# Altium project audio_interface.PrjPcb (part 2 of 2)

## Sheet bal2un_1.SchDoc
size A4
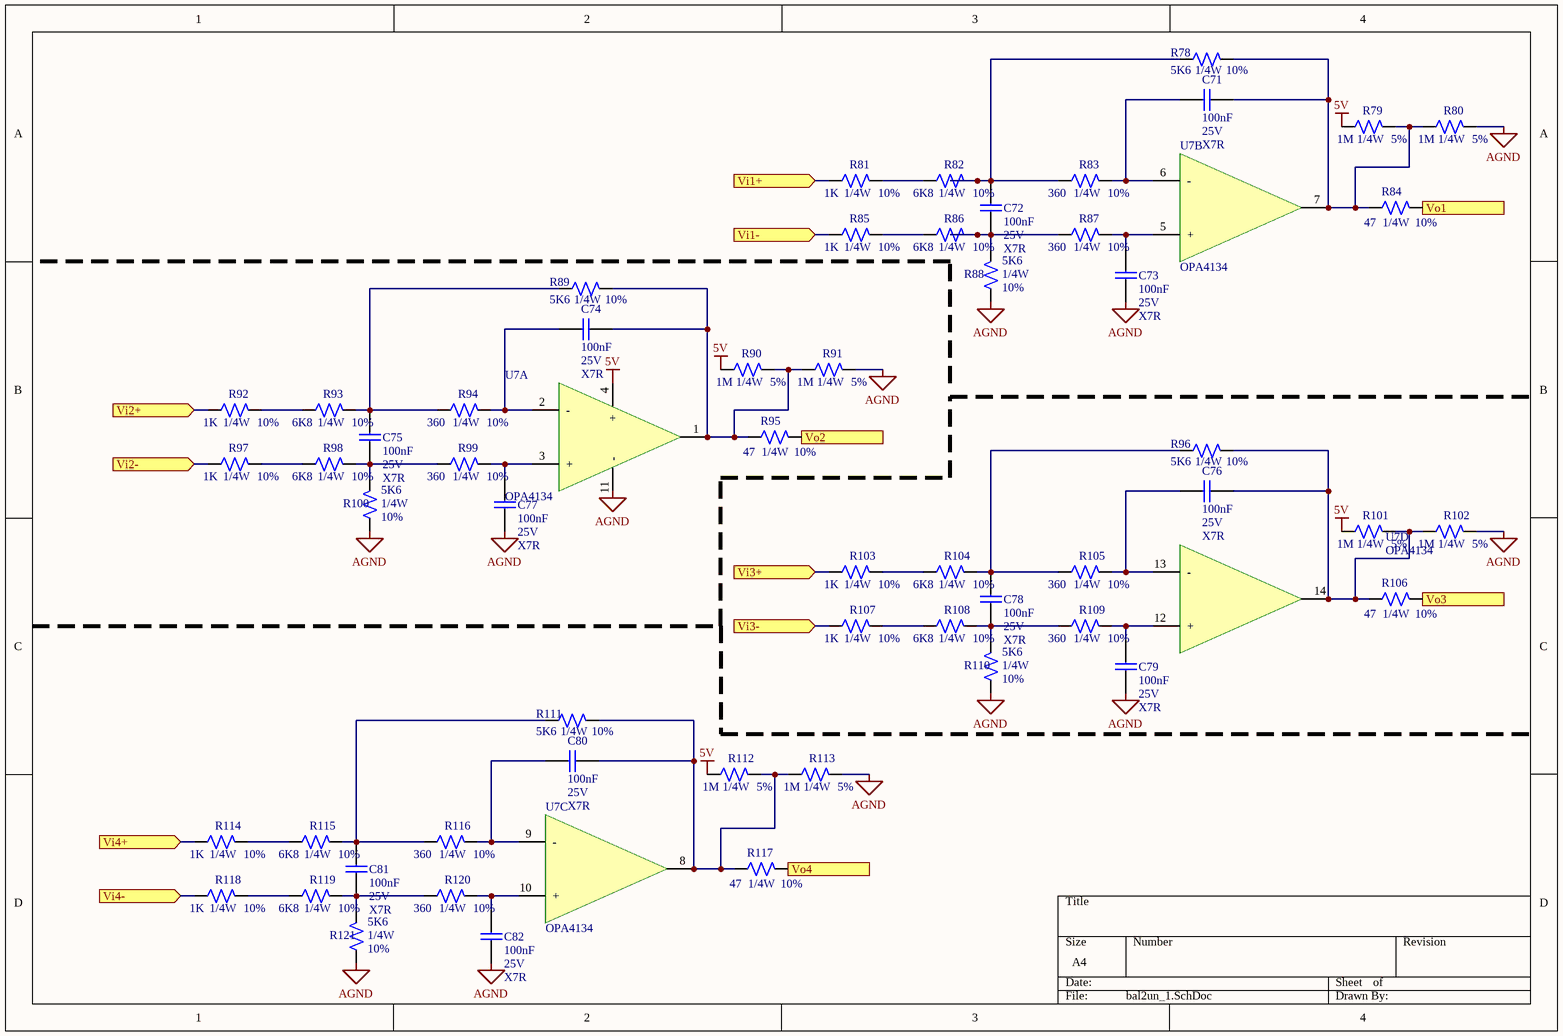
[diagram p12: bal2un_1.SchDoc]

### Parts
C71  valor: 100nF  tension: 25V  tolerancia: X7R  [C0805]  (hidden comment: Capacitor)
C72  valor: 100nF  tension: 25V  tolerancia: X7R  [C0805]  (hidden comment: Capacitor)
C73  valor: 100nF  tension: 25V  tolerancia: X7R  [C0805]  (hidden comment: Capacitor)
C74  valor: 100nF  tension: 25V  tolerancia: X7R  [C0805]  (hidden comment: Capacitor)
C75  valor: 100nF  tension: 25V  tolerancia: X7R  [C0805]  (hidden comment: Capacitor)
C76  valor: 100nF  tension: 25V  tolerancia: X7R  [C0805]  (hidden comment: Capacitor)
C77  valor: 100nF  tension: 25V  tolerancia: X7R  [C0805]  (hidden comment: Capacitor)
C78  valor: 100nF  tension: 25V  tolerancia: X7R  [C0805]  (hidden comment: Capacitor)
C79  valor: 100nF  tension: 25V  tolerancia: X7R  [C0805]  (hidden comment: Capacitor)
C80  valor: 100nF  tension: 25V  tolerancia: X7R  [C0805]  (hidden comment: Capacitor)
C81  valor: 100nF  tension: 25V  tolerancia: X7R  [C0805]  (hidden comment: Capacitor)
C82  valor: 100nF  tension: 25V  tolerancia: X7R  [C0805]  (hidden comment: Capacitor)
R78  Valor: 5K6  Potencia: 1/4W  Tolerancia: 10%  [R0805]  (hidden comment: Resistor)
R79  Valor: 1M  Potencia: 1/4W  Tolerancia: 5%  [R0805]  (hidden comment: Resistor)
R80  Valor: 1M  Potencia: 1/4W  Tolerancia: 5%  [R0805]  (hidden comment: Resistor)
R81  Valor: 1K  Potencia: 1/4W  Tolerancia: 10%  [R0805]  (hidden comment: Resistor)
R82  Valor: 6K8  Potencia: 1/4W  Tolerancia: 10%  [R0805]  (hidden comment: Resistor)
R83  Valor: 360  Potencia: 1/4W  Tolerancia: 10%  [R0805]  (hidden comment: Resistor)
R84  Valor: 47  Potencia: 1/4W  Tolerancia: 10%  [R0805]  (hidden comment: Resistor)
R85  Valor: 1K  Potencia: 1/4W  Tolerancia: 10%  [R0805]  (hidden comment: Resistor)
R86  Valor: 6K8  Potencia: 1/4W  Tolerancia: 10%  [R0805]  (hidden comment: Resistor)
R87  Valor: 360  Potencia: 1/4W  Tolerancia: 10%  [R0805]  (hidden comment: Resistor)
R88  Valor: 5K6  Potencia: 1/4W  Tolerancia: 10%  [R0805]  (hidden comment: Resistor)
R89  Valor: 5K6  Potencia: 1/4W  Tolerancia: 10%  [R0805]  (hidden comment: Resistor)
R90  Valor: 1M  Potencia: 1/4W  Tolerancia: 5%  [R0805]  (hidden comment: Resistor)
R91  Valor: 1M  Potencia: 1/4W  Tolerancia: 5%  [R0805]  (hidden comment: Resistor)
R92  Valor: 1K  Potencia: 1/4W  Tolerancia: 10%  [R0805]  (hidden comment: Resistor)
R93  Valor: 6K8  Potencia: 1/4W  Tolerancia: 10%  [R0805]  (hidden comment: Resistor)
R94  Valor: 360  Potencia: 1/4W  Tolerancia: 10%  [R0805]  (hidden comment: Resistor)
R95  Valor: 47  Potencia: 1/4W  Tolerancia: 10%  [R0805]  (hidden comment: Resistor)
R96  Valor: 5K6  Potencia: 1/4W  Tolerancia: 10%  [R0805]  (hidden comment: Resistor)
R97  Valor: 1K  Potencia: 1/4W  Tolerancia: 10%  [R0805]  (hidden comment: Resistor)
R98  Valor: 6K8  Potencia: 1/4W  Tolerancia: 10%  [R0805]  (hidden comment: Resistor)
R99  Valor: 360  Potencia: 1/4W  Tolerancia: 10%  [R0805]  (hidden comment: Resistor)
R100  Valor: 5K6  Potencia: 1/4W  Tolerancia: 10%  [R0805]  (hidden comment: Resistor)
R101  Valor: 1M  Potencia: 1/4W  Tolerancia: 5%  [R0805]  (hidden comment: Resistor)
R102  Valor: 1M  Potencia: 1/4W  Tolerancia: 5%  [R0805]  (hidden comment: Resistor)
R103  Valor: 1K  Potencia: 1/4W  Tolerancia: 10%  [R0805]  (hidden comment: Resistor)
R104  Valor: 6K8  Potencia: 1/4W  Tolerancia: 10%  [R0805]  (hidden comment: Resistor)
R105  Valor: 360  Potencia: 1/4W  Tolerancia: 10%  [R0805]  (hidden comment: Resistor)
R106  Valor: 47  Potencia: 1/4W  Tolerancia: 10%  [R0805]  (hidden comment: Resistor)
R107  Valor: 1K  Potencia: 1/4W  Tolerancia: 10%  [R0805]  (hidden comment: Resistor)
R108  Valor: 6K8  Potencia: 1/4W  Tolerancia: 10%  [R0805]  (hidden comment: Resistor)
R109  Valor: 360  Potencia: 1/4W  Tolerancia: 10%  [R0805]  (hidden comment: Resistor)
R110  Valor: 5K6  Potencia: 1/4W  Tolerancia: 10%  [R0805]  (hidden comment: Resistor)
R111  Valor: 5K6  Potencia: 1/4W  Tolerancia: 10%  [R0805]  (hidden comment: Resistor)
R112  Valor: 1M  Potencia: 1/4W  Tolerancia: 5%  [R0805]  (hidden comment: Resistor)
R113  Valor: 1M  Potencia: 1/4W  Tolerancia: 5%  [R0805]  (hidden comment: Resistor)
R114  Valor: 1K  Potencia: 1/4W  Tolerancia: 10%  [R0805]  (hidden comment: Resistor)
R115  Valor: 6K8  Potencia: 1/4W  Tolerancia: 10%  [R0805]  (hidden comment: Resistor)
R116  Valor: 360  Potencia: 1/4W  Tolerancia: 10%  [R0805]  (hidden comment: Resistor)
R117  Valor: 47  Potencia: 1/4W  Tolerancia: 10%  [R0805]  (hidden comment: Resistor)
R118  Valor: 1K  Potencia: 1/4W  Tolerancia: 10%  [R0805]  (hidden comment: Resistor)
R119  Valor: 6K8  Potencia: 1/4W  Tolerancia: 10%  [R0805]  (hidden comment: Resistor)
R120  Valor: 360  Potencia: 1/4W  Tolerancia: 10%  [R0805]  (hidden comment: Resistor)
R121  Valor: 5K6  Potencia: 1/4W  Tolerancia: 10%  [R0805]  (hidden comment: Resistor)
U7  OPA4134  [TSSOP-14]  (parts A,B,C,D of 4)

### Ports
Vi1+ (in), Vi1- (in), Vi2+ (in), Vi2- (in), Vi3+ (in), Vi3- (in), Vi4+ (in), Vi4- (in), Vo1 (out), Vo2 (out), Vo3 (out), Vo4 (out)

### Nets
5V: R79.1 R90.1 R101.1 R112.1 U7.4(+)
AGND: C73.2 C77.2 C79.2 C82.2 R80.2 R88.1 R91.2 R100.1 R102.2 R110.1 R113.2 R121.1 U7.11(-)
NetC17_1_1: R81.1 ; port Vi1+
NetC17_1_2: R85.1 ; port Vi1-
NetC17_2_1: R92.1 ; port Vi2+
NetC17_2_2: R97.1 ; port Vi2-
NetC17_3_1: R103.1 ; port Vi3+
NetC17_3_2: R107.1 ; port Vi3-
NetC17_4_1: R114.1 ; port Vi4+
NetC17_4_2: R118.1 ; port Vi4-
NetC57_1_2: R84.2 ; port Vo1
NetC57_2_2: R106.2 ; port Vo3
NetC58_1_2: R95.2 ; port Vo2
NetC58_2_2: R117.2 ; port Vo4
NetC71_1: C71.1 R78.2 R79.2 R80.1 R84.1 U7.7(OUT)
NetC71_2: C71.2 R83.2 U7.6(-)
NetC72_1: C72.1 R78.1 R82.2 R83.1
NetC72_2: C72.2 R86.2 R87.1 R88.2
NetC73_1: C73.1 R87.2 U7.5(+)
NetC74_1: C74.1 R89.2 R90.2 R91.1 R95.1 U7.1(OUT)
NetC74_2: C74.2 R94.2 U7.2(-)
NetC75_1: C75.1 R89.1 R93.2 R94.1
NetC75_2: C75.2 R98.2 R99.1 R100.2
NetC76_1: C76.1 R96.2 R101.2 R102.1 R106.1 U7.14(OUT)
NetC76_2: C76.2 R105.2 U7.13(-)
NetC77_1: C77.1 R99.2 U7.3(+)
NetC78_1: C78.1 R96.1 R104.2 R105.1
NetC78_2: C78.2 R108.2 R109.1 R110.2
NetC79_1: C79.1 R109.2 U7.12(+)
NetC80_1: C80.1 R111.2 R112.2 R113.1 R117.1 U7.8(OUT)
NetC80_2: C80.2 R116.2 U7.9(-)
NetC81_1: C81.1 R111.1 R115.2 R116.1
NetC81_2: C81.2 R119.2 R120.1 R121.2
NetC82_1: C82.1 R120.2 U7.10(+)
NetR81_2: R81.2 R82.1
NetR85_2: R85.2 R86.1
NetR92_2: R92.2 R93.1
NetR97_2: R97.2 R98.1
NetR103_2: R103.2 R104.1
NetR107_2: R107.2 R108.1
NetR114_2: R114.2 R115.1
NetR118_2: R118.2 R119.1

### Library data of the parts
C71-C82 = Capacitor: Capacitor de placas paralelas; Encapsulado: 0805
R78-R121 = Resistor: Resistencia
U7 = Opamp_x4: Integrado con 4 operacionales; Cod. Proveedor: 296-22024-1-ND; Proveedor: Digi-Key; Encapsulado: 8-SOIC; Fabricante: Texas Instruments; Link: https://www.digikey.com/product-detail/es/OPA2134UA-2K5/296-22024-1-ND/301154?utm_campaign=buynow&WT.z_cid=ref_octopart_dkc_buynow&utm_medium=aggregator&curr=usd&site=us&utm_source=octopart

## Sheet phantom_power_enabler.SchDoc
size A4
Used 6 times, as channels U_input/U_phantom_power_enabler_1, U_input/U_phantom_power_enabler_2, U_input/U_phantom_power_enabler_3, U_input/U_phantom_power_enabler_4, U_input/U_phantom_power_enabler_5, U_input/U_phantom_power_enabler_6. Parts and nets are listed once, with the designators drawn on the sheet.
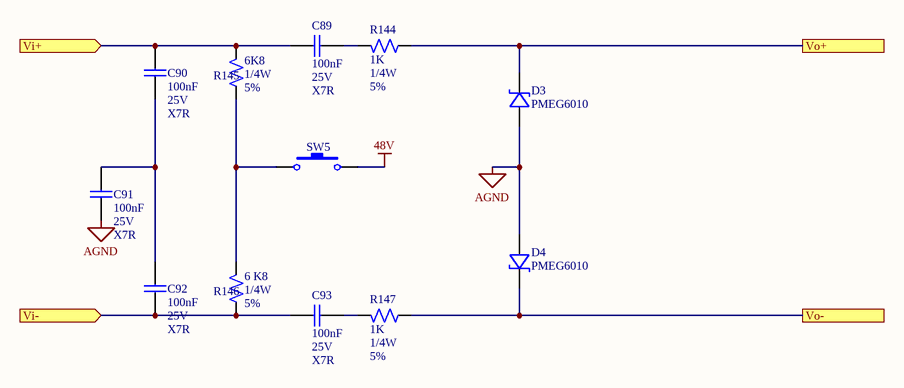
[diagram p13: phantom_power_enabler.SchDoc]

### Parts
C89  valor: 100nF  tension: 25V  tolerancia: X7R  [C0805]  (hidden comment: Capacitor)
C90  valor: 100nF  tension: 25V  tolerancia: X7R  [C0805]  (hidden comment: Capacitor)
C91  valor: 100nF  tension: 25V  tolerancia: X7R  [C0805]  (hidden comment: Capacitor)
C92  valor: 100nF  tension: 25V  tolerancia: X7R  [C0805]  (hidden comment: Capacitor)
C93  valor: 100nF  tension: 25V  tolerancia: X7R  [C0805]  (hidden comment: Capacitor)
D3  PMEG6010  [SOD128]
D4  PMEG6010  [SOD128]
R144  Valor: 1K  Potencia: 1/4W  Tolerancia: 5%  [R0805]  (hidden comment: Resistor)
R145  Valor: 6K8  Potencia: 1/4W  Tolerancia: 5%  [R0805]  (hidden comment: Resistor)
R146  Valor: 6 K8  Potencia: 1/4W  Tolerancia: 5%  [R0805]  (hidden comment: Resistor)
R147  Valor: 1K  Potencia: 1/4W  Tolerancia: 5%  [R0805]  (hidden comment: Resistor)
SW5  TAC_SWITCH_4  [Header 2x1]  (value not drawn)

### Ports
Vi+ (in), Vi- (in), Vo+, Vo-

### Nets
48V: SW5.2
AGND: C91.2 D3.2 D4.2
Vi+: C89.1 C90.1 R145.2 ; port Vi+
Vi-: C92.2 C93.1 R146.1 ; port Vi-
Vo+: D3.1 R144.1 ; port Vo+
Vo-: D4.1 R147.1 ; port Vo-
NetC89_2: C89.2 R144.2
NetC90_2: C90.2 C91.1 C92.1
NetC93_2: C93.2 R147.2
NetR145_1: R145.1 R146.2 SW5.1

### Channels
U_input/U_phantom_power_enabler_1: designators end in _1; ports Vi+=NetC89_1_1 Vi-=NetC92_1_2 Vo+=NetC17_1_1 Vo-=NetC17_1_2
U_input/U_phantom_power_enabler_2: designators end in _2; ports Vi+=NetC89_2_1 Vi-=NetC92_2_2 Vo+=NetC17_2_1 Vo-=NetC17_2_2
U_input/U_phantom_power_enabler_3: designators end in _3; ports Vi+=NetC89_3_1 Vi-=NetC92_3_2 Vo+=NetC17_3_1 Vo-=NetC17_3_2
U_input/U_phantom_power_enabler_4: designators end in _4; ports Vi+=NetC89_4_1 Vi-=NetC92_4_2 Vo+=NetC17_4_1 Vo-=NetC17_4_2
U_input/U_phantom_power_enabler_5: designators end in _5; ports Vi+=NetC89_5_1 Vi-=NetC92_5_2 Vo+=NetC17_5_1 Vo-=NetC17_5_2
U_input/U_phantom_power_enabler_6: designators end in _6; ports Vi+=NetC89_6_1 Vi-=NetC92_6_2 Vo+=NetC17_6_1 Vo-=NetC17_6_2

### Library data of the parts
C89-C93 = Capacitor: as C71-C82 on sheet bal2un_1
D3 D4 = Schottky Diode: Cod. Proveedor: 1727-5845-1-ND; Encapsulado: SOD-128; Proveedor: Digi-Key; Fabricante: Nexperia; Link: https://www.digikey.com/product-detail/es/PMEG6010EP,115/1727-5845-1-ND/2697507?utm_campaign=buynow&WT.z_cid=ref_octopart_dkc_buynow&utm_medium=aggregator&curr=usd&site=us&utm_source=octopart
R144-R147 = Resistor: Resistencia
SW5 = TAC_SWITCH_4: Pulsador de 4 pines; Proveedor: Digi-Key; Cod. Proveedor: GH1365-ND; Encapsulado: Montaje en panel, posterior; Fabricante: Grayhill Inc.; Link: https://www.digikey.com/product-detail/es/30-3/GH1365-ND/686796?utm_campaign=buynow&WT.z_cid=ref_octopart_dkc_buynow&utm_medium=aggregator&curr=usd&site=us&utm_source=octopart

## Nets that join several sheets
3V3_D: stm32 (14 pins), fuente (C2.1 U1.4), codec (8 pins), U_input/U_input_output_1 (R21_1.3 R22_1.2), U_input/U_input_output_2 (R21_2.3 R22_2.2), U_input/U_input_output_3 (R21_3.3 R22_3.2), U_input/U_input_output_4 (R21_4.3 R22_4.2), U_input/U_input_output_5 (R21_5.3 R22_5.2), U_input/U_input_output_6 (R21_6.3 R22_6.2)
5V: usb_2_0 (7 pins), stm32 (CN1.9 CN1.10), fuente (C1.1 U1.3), phantom_power (C68.1 L1.1 U6.4 U6.6), codec (12 pins), output_jack (U5.4), input (12 pins), U_input/U_preamp_1 (U4_1.4), U_input/U_preamp_2 (U4_2.4), bal2un_2 (R123.1 R134.1 U8.8), bal2un_1 (5 pins), U_input/U_preamp_3 (U4_3.4)
48V: phantom_power (C69.1 D2.1 R75.2), U_input/U_phantom_power_enabler_1 (SW5_1.2), U_input/U_phantom_power_enabler_2 (SW5_2.2), U_input/U_phantom_power_enabler_3 (SW5_3.2), U_input/U_phantom_power_enabler_4 (SW5_4.2), U_input/U_phantom_power_enabler_5 (SW5_5.2), U_input/U_phantom_power_enabler_6 (SW5_6.2)
AGND: phantom_power (5 pins), codec (23 pins), output_jack (7 pins), input (12 pins), U_input/U_input_output_1 (CN2_1.1 CN2_1.G CN2_1.S), U_input/U_preamp_1 (C59_1.2 C60_1.2 U4_1.11), U_input/U_preamp_2 (C59_2.2 C60_2.2 U4_2.11), bal2un_2 (7 pins), bal2un_1 (13 pins), U_input/U_preamp_3 (C59_3.2 C60_3.2 U4_3.11), U_input/U_phantom_power_enabler_1 (C91_1.2 D3_1.2 D4_1.2), U_input/U_input_output_2 (CN2_2.1 CN2_2.G CN2_2.S), U_input/U_phantom_power_enabler_2 (C91_2.2 D3_2.2 D4_2.2), U_input/U_input_output_3 (CN2_3.1 CN2_3.G CN2_3.S), U_input/U_phantom_power_enabler_3 (C91_3.2 D3_3.2 D4_3.2), U_input/U_input_output_4 (CN2_4.1 CN2_4.G CN2_4.S), U_input/U_phantom_power_enabler_4 (C91_4.2 D3_4.2 D4_4.2), U_input/U_input_output_5 (CN2_5.1 CN2_5.G CN2_5.S), U_input/U_phantom_power_enabler_5 (C91_5.2 D3_5.2 D4_5.2), U_input/U_input_output_6 (CN2_6.1 CN2_6.G CN2_6.S), U_input/U_phantom_power_enabler_6 (C91_6.2 D3_6.2 D4_6.2)
DGND: usb_2_0 (7 pins), stm32 (20 pins), fuente (C1.2 C2.2 U1.1), codec (8 pins), U_input/U_input_output_1 (C49_1.2 C50_1.2 R21_1.1 SW4_1.3), U_input/U_input_output_2 (C49_2.2 C50_2.2 R21_2.1 SW4_2.3), U_input/U_input_output_3 (C49_3.2 C50_3.2 R21_3.1 SW4_3.3), U_input/U_input_output_4 (C49_4.2 C50_4.2 R21_4.1 SW4_4.3), U_input/U_input_output_5 (C49_5.2 C50_5.2 R21_5.1 SW4_5.3), U_input/U_input_output_6 (C49_6.2 C50_6.2 R21_6.1 SW4_6.3)
VCOMAD: codec (C31.1 U3.1), U_input/U_preamp_1 (14 pins), U_input/U_preamp_2 (14 pins), U_input/U_preamp_3 (14 pins)
NetC16_1_2: U_input/U_input_output_1 (SW3_1.1), U_input/U_att_17db_1 (C16_1.2)
NetC16_2_2: U_input/U_input_output_2 (SW3_2.1), U_input/U_att_17db_2 (C16_2.2)
NetC16_3_2: U_input/U_input_output_3 (SW3_3.1), U_input/U_att_17db_3 (C16_3.2)
NetC16_4_2: U_input/U_input_output_4 (SW3_4.1), U_input/U_att_17db_4 (C16_4.2)
NetC16_5_2: U_input/U_input_output_5 (SW3_5.1), U_input/U_att_17db_5 (C16_5.2)
NetC16_6_2: U_input/U_input_output_6 (SW3_6.1), U_input/U_att_17db_6 (C16_6.2)
NetC17_1_1: input (R51.2 R52.1), U_input/U_input_output_1 (SW3_1.3), U_input/U_att_17db_1 (C17_1.1 R8_1.2 R9_1.2), bal2un_1 (R81.1), U_input/U_phantom_power_enabler_1 (D3_1.1 R144_1.1)
NetC17_1_2: input (R53.2 R54.1), U_input/U_input_output_1 (SW3_1.6), U_input/U_att_17db_1 (C17_1.2 R9_1.1 R10_1.2), bal2un_1 (R85.1), U_input/U_phantom_power_enabler_1 (D4_1.1 R147_1.1)
NetC17_2_1: input (R55.2 R56.1), bal2un_1 (R92.1), U_input/U_input_output_2 (SW3_2.3), U_input/U_att_17db_2 (C17_2.1 R8_2.2 R9_2.2), U_input/U_phantom_power_enabler_2 (D3_2.1 R144_2.1)
NetC17_2_2: input (R57.2 R58.1), bal2un_1 (R97.1), U_input/U_input_output_2 (SW3_2.6), U_input/U_att_17db_2 (C17_2.2 R9_2.1 R10_2.2), U_input/U_phantom_power_enabler_2 (D4_2.1 R147_2.1)
NetC17_3_1: input (R59.2 R60.1), bal2un_1 (R103.1), U_input/U_input_output_3 (SW3_3.3), U_input/U_att_17db_3 (C17_3.1 R8_3.2 R9_3.2), U_input/U_phantom_power_enabler_3 (D3_3.1 R144_3.1)
NetC17_3_2: input (R61.2 R62.1), bal2un_1 (R107.1), U_input/U_input_output_3 (SW3_3.6), U_input/U_att_17db_3 (C17_3.2 R9_3.1 R10_3.2), U_input/U_phantom_power_enabler_3 (D4_3.1 R147_3.1)
NetC17_4_1: input (R63.2 R64.1), bal2un_1 (R114.1), U_input/U_input_output_4 (SW3_4.3), U_input/U_att_17db_4 (C17_4.1 R8_4.2 R9_4.2), U_input/U_phantom_power_enabler_4 (D3_4.1 R144_4.1)
NetC17_4_2: input (R65.2 R66.1), bal2un_1 (R118.1), U_input/U_input_output_4 (SW3_4.6), U_input/U_att_17db_4 (C17_4.2 R9_4.1 R10_4.2), U_input/U_phantom_power_enabler_4 (D4_4.1 R147_4.1)
NetC17_5_1: input (R67.2 R68.1), bal2un_2 (R125.1), U_input/U_input_output_5 (SW3_5.3), U_input/U_att_17db_5 (C17_5.1 R8_5.2 R9_5.2), U_input/U_phantom_power_enabler_5 (D3_5.1 R144_5.1)
NetC17_5_2: input (R69.2 R70.1), bal2un_2 (R129.1), U_input/U_input_output_5 (SW3_5.6), U_input/U_att_17db_5 (C17_5.2 R9_5.1 R10_5.2), U_input/U_phantom_power_enabler_5 (D4_5.1 R147_5.1)
NetC17_6_1: input (R71.2 R72.1), bal2un_2 (R136.1), U_input/U_input_output_6 (SW3_6.3), U_input/U_att_17db_6 (C17_6.1 R8_6.2 R9_6.2), U_input/U_phantom_power_enabler_6 (D3_6.1 R144_6.1)
NetC17_6_2: input (R73.2 R74.1), bal2un_2 (R140.1), U_input/U_input_output_6 (SW3_6.6), U_input/U_att_17db_6 (C17_6.2 R9_6.1 R10_6.2), U_input/U_phantom_power_enabler_6 (D4_6.1 R147_6.1)
NetC18_1_2: U_input/U_input_output_1 (SW3_1.4), U_input/U_att_17db_1 (C18_1.2)
NetC18_2_2: U_input/U_input_output_2 (SW3_2.4), U_input/U_att_17db_2 (C18_2.2)
NetC18_3_2: U_input/U_input_output_3 (SW3_3.4), U_input/U_att_17db_3 (C18_3.2)
NetC18_4_2: U_input/U_input_output_4 (SW3_4.4), U_input/U_att_17db_4 (C18_4.2)
NetC18_5_2: U_input/U_input_output_5 (SW3_5.4), U_input/U_att_17db_5 (C18_5.2)
NetC18_6_2: U_input/U_input_output_6 (SW3_6.4), U_input/U_att_17db_6 (C18_6.2)
NetC33_1: codec (C33.1), U_input/U_preamp_1 (C53_1.1 R24_1.2 R26_1.2)
NetC34_1: codec (C34.1), U_input/U_preamp_1 (C53_1.2 R28_1.1 R30_1.2 R36_1.2)
NetC37_1: codec (C37.1), U_input/U_preamp_1 (C54_1.1 R25_1.2 R27_1.2)
NetC38_1: codec (C38.1), U_input/U_preamp_1 (C54_1.2 R29_1.1 R31_1.2 R37_1.2)
NetC39_1: codec (C39.1), U_input/U_preamp_2 (C53_2.1 R24_2.2 R26_2.2)
NetC40_1: codec (C40.1), U_input/U_preamp_2 (C53_2.2 R28_2.1 R30_2.2 R36_2.2)
NetC41_1: codec (C41.1), U_input/U_preamp_2 (C54_2.1 R25_2.2 R27_2.2)
NetC42_1: codec (C42.1), U_input/U_preamp_2 (C54_2.2 R29_2.1 R31_2.2 R37_2.2)
NetC43_1: codec (C43.1), U_input/U_preamp_3 (C53_3.1 R24_3.2 R26_3.2)
NetC44_1: codec (C44.1), U_input/U_preamp_3 (C53_3.2 R28_3.1 R30_3.2 R36_3.2)
NetC45_1: codec (C45.1), U_input/U_preamp_3 (C54_3.1 R25_3.2 R27_3.2)
NetC46_1: codec (C46.1), U_input/U_preamp_3 (C54_3.2 R29_3.1 R31_3.2 R37_3.2)
NetC49_1_1: stm32 (U2.22), U_input/U_input_output_1 (C49_1.1 R23_1.2)
NetC49_2_1: stm32 (U2.58), U_input/U_input_output_2 (C49_2.1 R23_2.2)
NetC49_3_1: stm32 (U2.26), U_input/U_input_output_3 (C49_3.1 R23_3.2)
NetC49_4_1: stm32 (U2.27), U_input/U_input_output_4 (C49_4.1 R23_4.2)
NetC49_5_1: stm32 (U2.55), U_input/U_input_output_5 (C49_5.1 R23_5.2)
NetC49_6_1: stm32 (U2.25), U_input/U_input_output_6 (C49_6.1 R23_6.2)
NetC50_1_1: stm32 (U2.59), U_input/U_input_output_1 (C50_1.1 R22_1.1 SW4_1.2)
NetC50_2_1: stm32 (U2.23), U_input/U_input_output_2 (C50_2.1 R22_2.1 SW4_2.2)
NetC50_3_1: stm32 (U2.57), U_input/U_input_output_3 (C50_3.1 R22_3.1 SW4_3.2)
NetC50_4_1: stm32 (U2.56), U_input/U_input_output_4 (C50_4.1 R22_4.1 SW4_4.2)
NetC50_5_1: stm32 (U2.24), U_input/U_input_output_5 (C50_5.1 R22_5.1 SW4_5.2)
NetC50_6_1: stm32 (U2.54), U_input/U_input_output_6 (C50_6.1 R22_6.1 SW4_6.2)
NetC57_1_2: U_input/U_preamp_1 (C57_1.2), bal2un_1 (R84.2)
NetC57_2_2: U_input/U_preamp_2 (C57_2.2), bal2un_1 (R106.2)
NetC57_3_2: bal2un_2 (R128.2), U_input/U_preamp_3 (C57_3.2)
NetC58_1_2: U_input/U_preamp_1 (C58_1.2), bal2un_1 (R95.2)
NetC58_2_2: U_input/U_preamp_2 (C58_2.2), bal2un_1 (R117.2)
NetC58_3_2: bal2un_2 (R139.2), U_input/U_preamp_3 (C58_3.2)
NetC62_2: codec (U3.31), output_jack (C62.2)
NetC65_2: codec (U3.32), output_jack (C65.2)
NetC89_1_1: U_input/U_input_output_1 (CN2_1.2), U_input/U_phantom_power_enabler_1 (C89_1.1 C90_1.1 R145_1.2)
NetC89_2_1: U_input/U_input_output_2 (CN2_2.2), U_input/U_phantom_power_enabler_2 (C89_2.1 C90_2.1 R145_2.2)
NetC89_3_1: U_input/U_input_output_3 (CN2_3.2), U_input/U_phantom_power_enabler_3 (C89_3.1 C90_3.1 R145_3.2)
NetC89_4_1: U_input/U_input_output_4 (CN2_4.2), U_input/U_phantom_power_enabler_4 (C89_4.1 C90_4.1 R145_4.2)
NetC89_5_1: U_input/U_input_output_5 (CN2_5.2), U_input/U_phantom_power_enabler_5 (C89_5.1 C90_5.1 R145_5.2)
NetC89_6_1: U_input/U_input_output_6 (CN2_6.2), U_input/U_phantom_power_enabler_6 (C89_6.1 C90_6.1 R145_6.2)
NetC92_1_2: U_input/U_input_output_1 (CN2_1.3), U_input/U_phantom_power_enabler_1 (C92_1.2 C93_1.1 R146_1.1)
NetC92_2_2: U_input/U_input_output_2 (CN2_2.3), U_input/U_phantom_power_enabler_2 (C92_2.2 C93_2.1 R146_2.1)
NetC92_3_2: U_input/U_input_output_3 (CN2_3.3), U_input/U_phantom_power_enabler_3 (C92_3.2 C93_3.1 R146_3.1)
NetC92_4_2: U_input/U_input_output_4 (CN2_4.3), U_input/U_phantom_power_enabler_4 (C92_4.2 C93_4.1 R146_4.1)
NetC92_5_2: U_input/U_input_output_5 (CN2_5.3), U_input/U_phantom_power_enabler_5 (C92_5.2 C93_5.1 R146_5.1)
NetC92_6_2: U_input/U_input_output_6 (CN2_6.3), U_input/U_phantom_power_enabler_6 (C92_6.2 C93_6.1 R146_6.1)
NetR4_2: usb_2_0 (R4.2), stm32 (U2.42)
NetR5_2: usb_2_0 (R5.2), stm32 (U2.44)
NetR6_2: usb_2_0 (R6.2), stm32 (U2.45)
NetR7_2: usb_2_0 (R7.2), stm32 (U2.43)
NetR12_2: stm32 (U2.33), codec (R12.2 R13.1)
NetR14_2: stm32 (U2.29), codec (R14.2 R15.1)
NetR16_2: stm32 (U2.37), codec (R16.2)
NetR17_1: stm32 (U2.10), codec (R17.1)
NetR18_2: stm32 (U2.11), codec (R18.2)
NetR19_1: stm32 (U2.52), codec (R19.1)
NetR20_2: stm32 (U2.53), codec (R20.2)